# EAGLE design Photon_Micro_OLED_Shield (EAGLE 7.1.0)
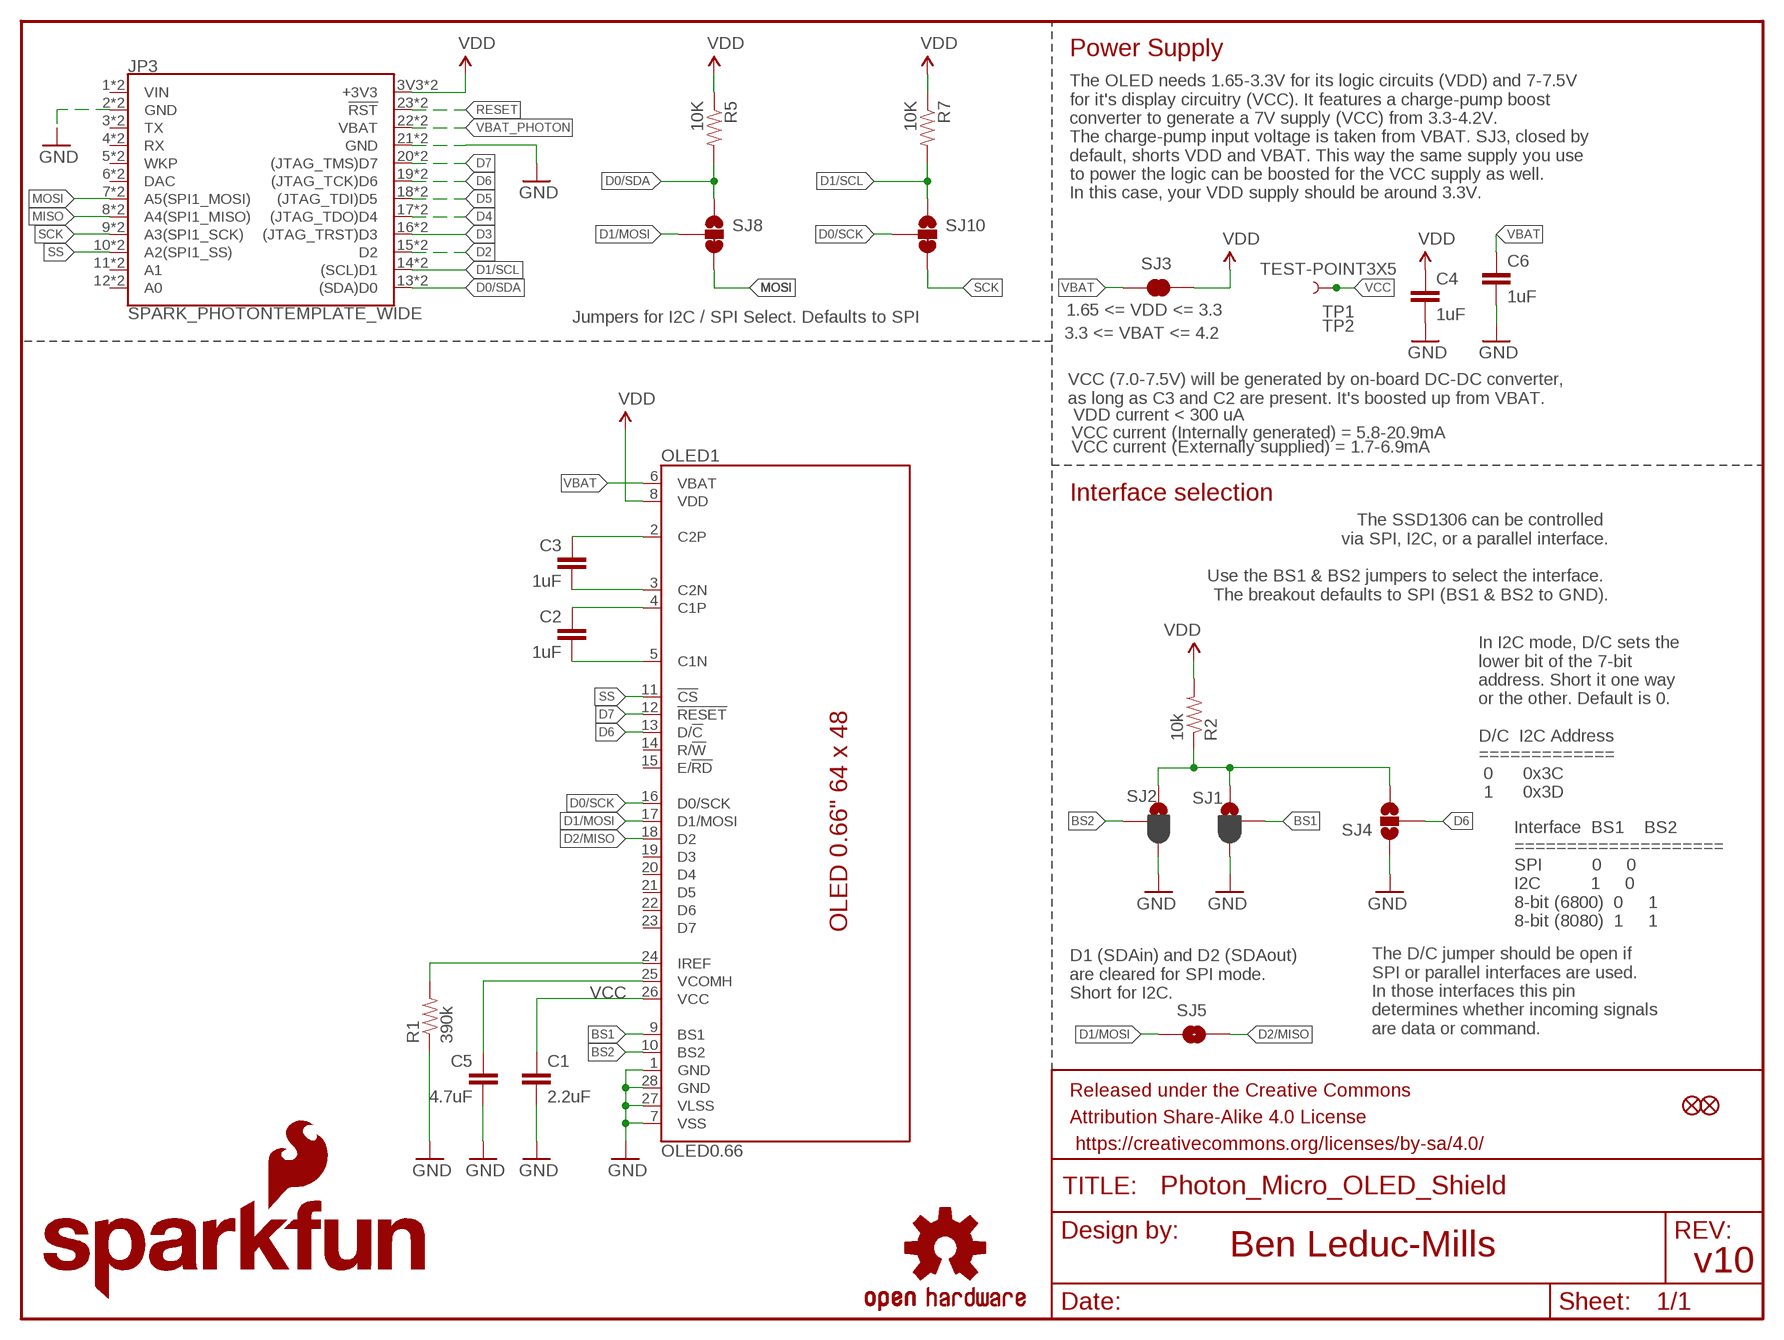
[diagram p0: schematic, sheet 1]

## Parts
C1  2.2uF  2.2UF-25V-+80/-20(0805)  [0805-CAP]
C2  1uF  1UF-25V-10%(0805)"  [0805-CAP]
C3  1uF  1UF-25V-10%(0805)"  [0805-CAP]
C4  1uF  CAP0603-CAP  [0603-CAP]
C5  4.7uF  4.7UF-16V-20%,+80%-(1206)  [1206-CAP]
C6  1uF  CAP0603-CAP  [0603-CAP]
FID1  FIDUCIAL1X2  [FIDUCIAL-1X2]
FID2  FIDUCIAL1X2  [FIDUCIAL-1X2]
FRAME1  FRAME-LETTER  [CREATIVE_COMMONS]
JP3  SPARK_PHOTONTEMPLATE_WIDE  [SPARK_PHOTON_TEMPLATE_WIDE]
LOGO1  SFE_LOGO_NAME_FLAME.1_INCH  [SFE_LOGO_NAME_FLAME_.1]
LOGO2  SFE_LOGO_NAME_FLAME.1_INCH  [SFE_LOGO_NAME_FLAME_.1]
LOGO3  OSHW-LOGOS  [OSHW-LOGO-S]
OLED1  OLED0.66  [OLED-0.66-64X48]
R1  390k  RESISTOR0603-RES  [0603-RES]
R2  10k  RESISTOR0603-RES  [0603-RES]
R5  10K  10KOHM1/10W1%(0603)0603  [0603-RES]
R7  10K  10KOHM1/10W1%(0603)0603  [0603-RES]
SJ1  BS1  JUMPER-PAD-3-2OF3_NC_BY_PASTE  [PAD-JUMPER-3-2OF3_NC_BY_PASTE_YES_SILK_FULL_BOX]
SJ2  BS2  JUMPER-PAD-3-2OF3_NC_BY_PASTE  [PAD-JUMPER-3-2OF3_NC_BY_PASTE_YES_SILK_FULL_BOX]
SJ3  JUMPER-PAD-2-NC_BY_TRACE  [PAD-JUMPER-2-NC_BY_TRACE_YES_SILK]
SJ4  JUMPER-PAD-3-NOYES_SILK  [PAD-JUMPER-3-NO_YES_SILK]
SJ5  JUMPER-PAD-2-NOYES_SILK  [PAD-JUMPER-2-NO_YES_SILK]
SJ8  JUMPER-PAD-3-2OF3_NC_BY_TRACE_SMALL  [PAD-JUMPER-3-2OF3_NC_BY_TRACE_YES_SILK_FULL_BOX]
SJ10  JUMPER-PAD-3-2OF3_NC_BY_TRACE_SMALL  [PAD-JUMPER-3-2OF3_NC_BY_TRACE_YES_SILK_FULL_BOX]
TP1  TEST-POINT3X5  [PAD.03X.05]
TP2  TEST-POINT3X5  [PAD.03X.05]

## Nets
BS1: OLED1.9(BS1) SJ1.2
BS2: OLED1.10(BS2) SJ2.2
C1N: C2.2 OLED1.5(C1N)
C1P: C2.1 OLED1.4(C1P)
C2N: C3.2 OLED1.3(C2N)
C2P: C3.1 OLED1.2(C2P)
D0/SCK: OLED1.16(D0/SCK) SJ10.2
D0/SDA: JP3.13((SDA)D0) JP3.D0((SDA)D0) R5.2 SJ8.1
D1/MOSI: OLED1.17(D1/MOSI) SJ5.1 SJ8.2
D1/SCL: JP3.14((SCL)D1) JP3.D1((SCL)D1) R7.2 SJ10.1
D2: JP3.15(D2) JP3.D2
D2/MISO: OLED1.18(D2) SJ5.2
D3: JP3.16((JTAG_TRST)D3) JP3.D3((JTAG_TRST)D3)
D4: JP3.17((JTAG_TDO)D4) JP3.D4((JTAG_TDO)D4)
D5: JP3.18((JTAG_TDI)D5) JP3.D5((JTAG_TDI)D5)
D6: JP3.19((JTAG_TCK)D6) JP3.D6((JTAG_TCK)D6) OLED1.13(D/!C!) SJ4.2
D7: JP3.20((JTAG_TMS)D7) JP3.D7((JTAG_TMS)D7) OLED1.12(!RESET!)
GND: C1.2 C4.2 C5.2 C6.2 JP3.2(GND) JP3.21(GND) JP3.GND@0(GND) JP3.GND@2(GND) OLED1.1(GND) OLED1.7(VSS) OLED1.27(VLSS) OLED1.28(GND) R1.1 SJ1.3 SJ2.3 SJ4.1
IREF: OLED1.24(IREF) R1.2
MISO: JP3.8(A4(SPI1_MISO)) JP3.A4(A4(SPI1_MISO))
MOSI: JP3.7(A5(SPI1_MOSI)) JP3.A5(A5(SPI1_MOSI)) SJ8.3
RESET: JP3.23(!RST!) JP3.RST(!RST!)
SCK: JP3.9(A3(SPI1_SCK)) JP3.A3(A3(SPI1_SCK)) SJ10.3
SS: JP3.10(A2(SPI1_SS)) JP3.A2(A2(SPI1_SS)) OLED1.11(!CS!)
VBAT: C6.1 OLED1.6(VBAT) SJ3.1
VBAT_PHOTON: JP3.22(VBAT) JP3.VBAT
VCC: C1.1 OLED1.26(VCC) TP1.P$1 TP2.P$1
VCOMH: C5.1 OLED1.25(VCOMH)
VDD: C4.1 JP3.3V3(+3V3) JP3.24(+3V3) OLED1.8(VDD) R2.2 R5.1 R7.1 SJ3.2
VDD_PU: R2.1 SJ1.1 SJ2.1 SJ4.3
Unconnected: JP3.1(VIN) JP3.3(TX) JP3.4(RX) JP3.5(WKP) JP3.6(DAC) JP3.11(A1) JP3.12(A0) JP3.A0 JP3.A1 JP3.DAC JP3.RX JP3.TX JP3.VIN JP3.WKP OLED1.14(R/!W!) OLED1.15(E/!RD!) OLED1.19(D3) OLED1.20(D4) OLED1.21(D5) OLED1.22(D6) OLED1.23(D7)

## Notes on the sheet
- Power Supply
- The OLED needs 1.65-3.3V for its logic circuits (VDD) and 7-7.5V
  for it's display circuitry (VCC). It features a charge-pump boost 
  converter to generate a 7V supply (VCC) from 3.3-4.2V. 
  The charge-pump input voltage is taken from VBAT. SJ3, closed by 
  default, shorts VDD and VBAT. This way the same supply you use 
  to power the logic can be boosted for the VCC supply as well. 
  In this case, your VDD supply should be around 3.3V.
- 1.65 <= VDD <= 3.3
- Jumpers for I2C / SPI Select. Defaults to SPI
- 3.3 <= VBAT <= 4.2
- VCC (7.0-7.5V) will be generated by on-board DC-DC converter, 
  as long as C3 and C2 are present. It's boosted up from VBAT.
- VDD current < 300 uA
- VCC current (Internally generated) = 5.8-20.9mA
- VCC current (Externally supplied) = 1.7-6.9mA
- Interface selection
- The SSD1306 can be controlled 
  via SPI, I2C, or a parallel interface.
  
  Use the BS1 & BS2 jumpers to select the interface. 
  The breakout defaults to SPI (BS1 & BS2 to GND).
- In I2C mode, D/C sets the 
  lower bit of the 7-bit 
  address. Short it one way
  or the other. Default is 0. 
  
  D/C  I2C Address
  =============
   0      0x3C
   1      0x3D
- Interface  BS1    BS2
  ====================
  SPI          0     0
  I2C          1     0
  8-bit (6800)  0     1
  8-bit (8080)  1     1
- D1 (SDAin) and D2 (SDAout)
  are cleared for SPI mode. 
  Short for I2C.
- The D/C jumper should be open if
  SPI or parallel interfaces are used.
  In those interfaces this pin 
  determines whether incoming signals 
  are data or command.
- Ben Leduc-Mills
- v10

## Library data of the parts
C1 = SparkFun-Capacitors:2.2UF-25V-+80/-20(0805): CAP-11624; PROD_ID: CAP-11624
C2 C3 = SparkFun-Capacitors:1UF-25V-10%(0805): CAP-08064
C4 C6 = SparkFun-Passives:CAP: Capacitor Standard 0603 ceramic capacitor, and 0.1" leaded capacitor.; PROD_ID: CAP-00868
C5 = SparkFun-Capacitors:4.7UF-16V-20%,+80%-(1206): CAP-10300; PROD_ID: CAP-10300
FID1 FID2 = SparkFun-Aesthetics:FIDUCIAL: Fiducial Alignment Points Various fiducial points for machine vision alignment.
FRAME1 = SparkFun-Aesthetics:FRAME-LETTER: Schematic Frame Standard 8.5x11 US Letter frame; DESIGNER: NAME; VERSION: v01
JP3 = template_temp:SPARK_PHOTON
LOGO1 LOGO2 = SparkFun-Aesthetics:SFE_LOGO_NAME_FLAME: SFE Logo, name and flame This is the SparkFun full logo. The logo on the schematic will always be the same size; the package variant is the height of the flame part of the logo. Default layer for the logo on the board is tSilk.
LOGO3 = SparkFun-Aesthetics:OSHW-LOGO: Open Source Hardware Logo This logo indicates the piece of hardware it is found on incorporates a OSHW license and/or adheres to the definition of open source hardware found here: http://freedomdefined.org/OSHW
OLED1 = microView-temp:OLED0.66; PROD_ID: LCD-12019
R1 = SparkFun-Passives:RESISTOR: Resistor Basic schematic elements and footprints for 0603, 1206, and PTH resistors.; PROD_ID: RES-12024
R2 = SparkFun-Passives:RESISTOR: Resistor Basic schematic elements and footprints for 0603, 1206, and PTH resistors.; PROD_ID: RES-00824
R5 R7 = SparkFun-Resistors:10KOHM1/10W1%(0603): RES-00824; PROD_ID: RES-00824
SJ1 SJ2 = SparkFun-Passives:JUMPER-PAD-3-2OF3_NC_BY_PASTE
SJ3 = SparkFun-Passives:JUMPER-PAD-2-NC_BY_TRACE
SJ4 = SparkFun-Passives:JUMPER-PAD-3-NO
SJ5 = SparkFun-Passives:JUMPER-PAD-2-NO
SJ8 SJ10 = SparkFun-Passives:JUMPER-PAD-3-2OF3_NC_BY_TRACE
TP1 TP2 = SparkFun-Passives:TEST-POINT: Bare copper test points for troubleshooting or ICT

## Board
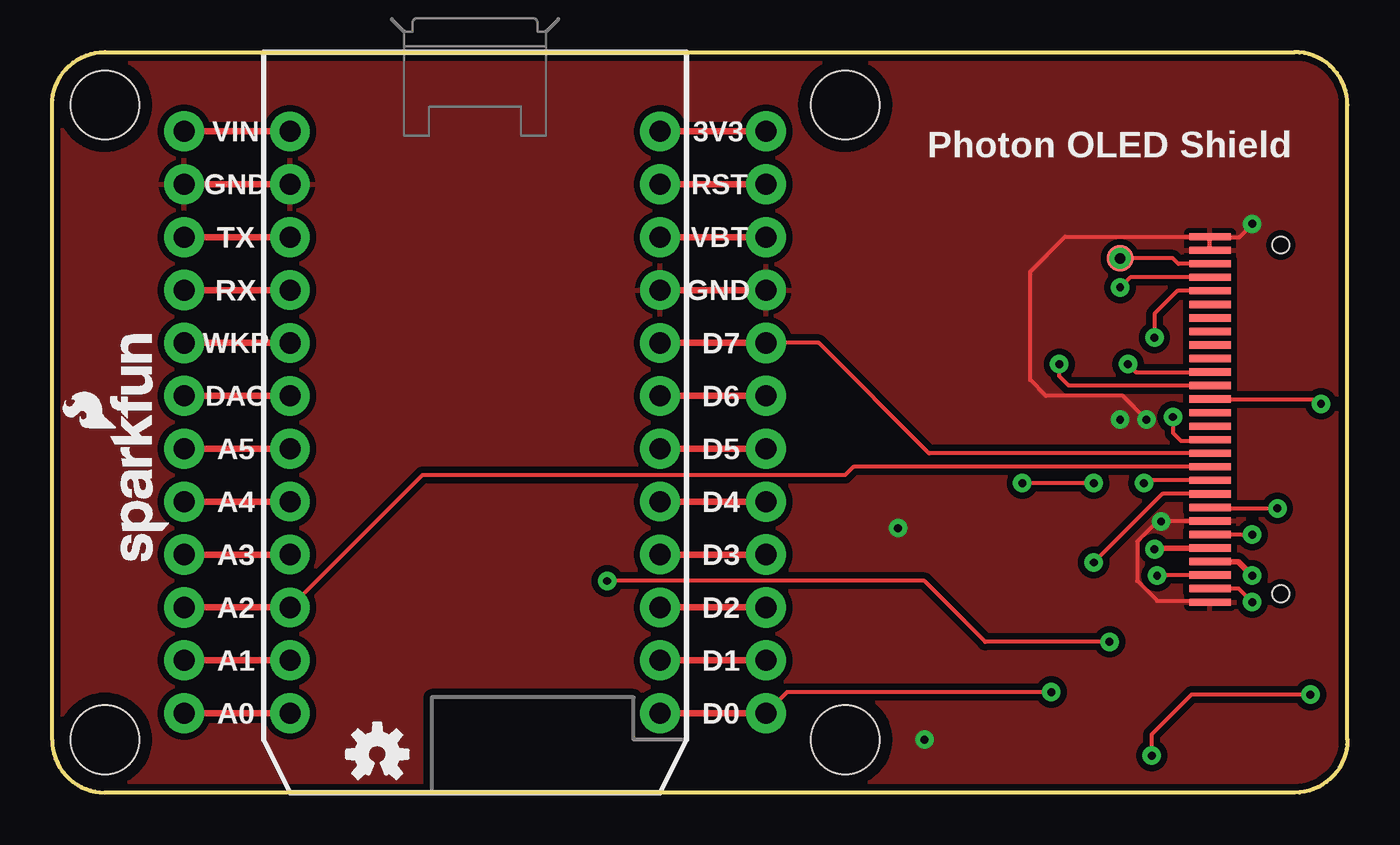
[diagram p1: board, top side]
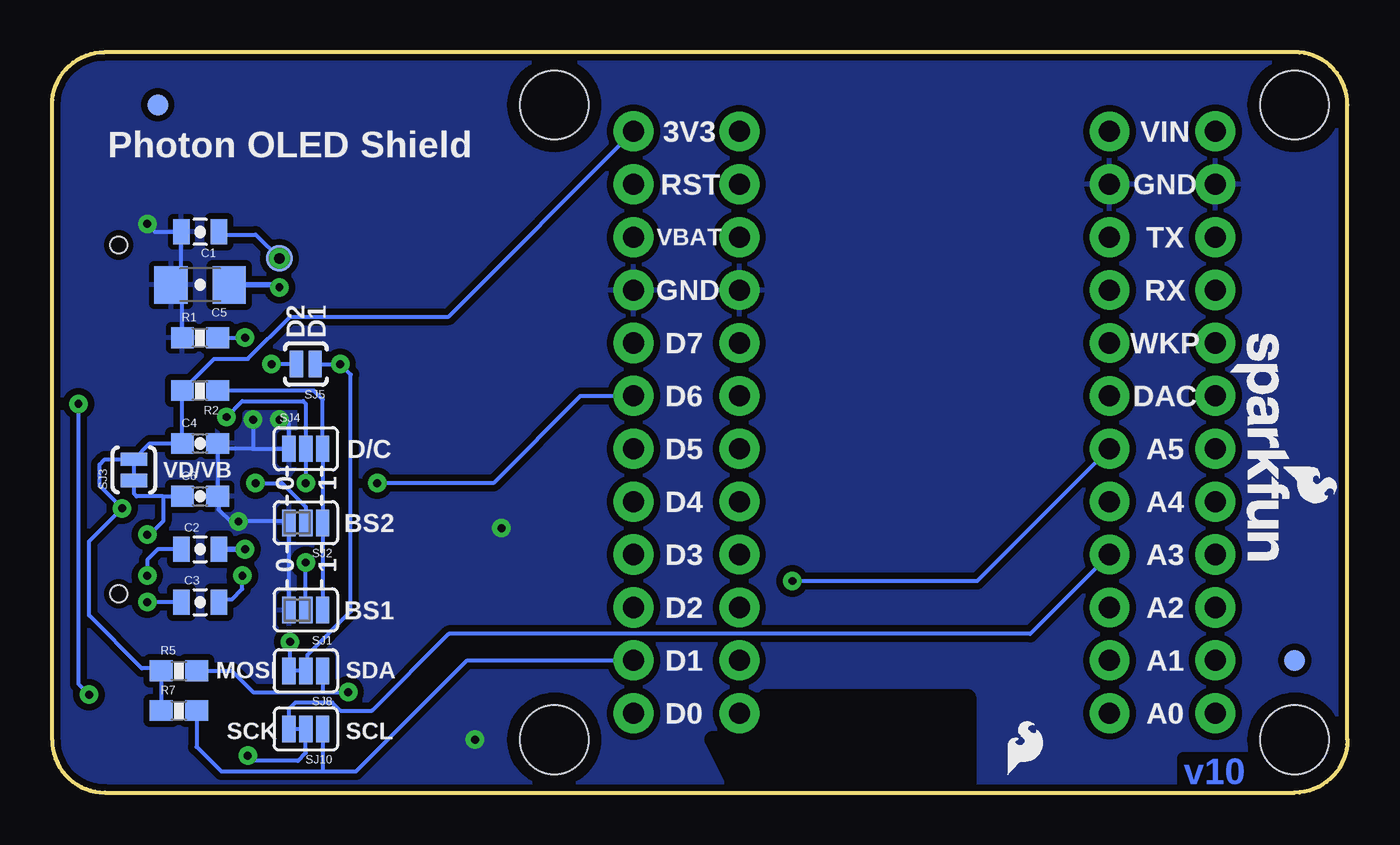
[diagram p2: board, bottom side, seen from below]

Size 62.23 x 35.56 mm. Coordinates in mm from the lower left corner, seen from the top.
Outline: 2.54,35.56 59.69,35.56 arc-90 62.23,33.02 62.23,2.54 arc-90 59.69,0 2.54,0 arc-90 0,2.54 0,33.02 arc-90 2.54,35.56
Copper layers (1*16): Top 0.035mm / dielectric 1.5mm / Bottom 0.035mm
Design rules "SparkFun-2-layer": minimum track width 7mil, minimum drill 15mil, track to track 8mil, track to pad 8mil, pad to pad 8mil, via to via 8mil, smd to smd 8mil, copper to edge 8mil, drill to drill 8mil, minimum pad ring 12mil, minimum via ring 10mil, stop-mask expansion 4mil, vias tented up to drill 20mil, thermal gap 10mil

### Footprints (pad centres in the part's own frame; a part is rotated, then mirrored left to right if it is on the bottom)
0805-CAP = smd 0.8 x 1.2: 1 -0.9,0; 2 0.9,0
0603-CAP = smd 1.1 x 1: 1 -0.85,0; 2 0.85,0
1206-CAP = smd 1.6 x 1.8: 1 -1.4,0; 2 1.4,0
FIDUCIAL-1X2 = smd 1 x 1: 1 0,0
SPARK_PHOTON_TEMPLATE_WIDE = drill 1.016 pad 1.905: 1 1.27,31.75; 2 1.27,29.21; 3 1.27,26.67; 4 1.27,24.13; 5 1.27,21.59; 6 1.27,19.05; 7 1.27,16.51; 8 1.27,13.97; 9 1.27,11.43; 10 1.27,8.89; 11 1.27,6.35; 12 1.27,3.81; 13 19.05,3.81; 14 19.05,6.35; 15 19.05,8.89; 16 19.05,11.43; 17 19.05,13.97; 18 19.05,16.51; 19 19.05,19.05; 20 19.05,21.59; 21 19.05,24.13; 22 19.05,26.67; 23 19.05,29.21; 24 19.05,31.75 | drill 1.016 pad 1.93: 3V3 24.13,31.75; A0 -3.81,3.81; A1 -3.81,6.35; A2 -3.81,8.89; A3 -3.81,11.43; A4 -3.81,13.97; A5 -3.81,16.51; D0 24.13,3.81; D1 24.13,6.35; D2 24.13,8.89; D3 24.13,11.43; D4 24.13,13.97; D5 24.13,16.51; D6 24.13,19.05; D7 24.13,21.59; DAC -3.81,19.05; GND@0 -3.81,29.21; GND@2 24.13,24.13; RST 24.13,29.21; RX -3.81,24.13; TX -3.81,26.67; VBAT 24.13,26.67; VIN -3.81,31.75; WKP -3.81,21.59 | hole 3.302: -7.62,33.02; 27.94,33.02; -7.62,2.54; 27.94,2.54
OLED-0.66-64X48 = smd 0.35 x 2: 1 0,0; 2 0.65,0; 3 1.3,0; 4 1.95,0; 5 2.6,0; 6 3.25,0; 7 3.9,0; 8 4.55,0; 9 5.2,0; 10 5.85,0; 11 6.5,0; 12 7.15,0; 13 7.8,0; 14 8.45,0; 15 9.1,0; 16 9.75,0; 17 10.4,0; 18 11.05,0; 19 11.7,0; 20 12.35,0; 21 13,0; 22 13.65,0; 23 14.3,0; 24 14.95,0; 25 15.6,0; 26 16.25,0; 27 16.9,0; 28 17.55,0 | hole 0.8: 17.15,-3.4; 0.4,-3.4
0603-RES = smd 1.1 x 1: 1 -0.85,0; 2 0.85,0
PAD-JUMPER-3-2OF3_NC_BY_PASTE_YES_SILK_FULL_BOX = smd 0.635 x 1.27: 1 -0.813,0; 2 0,0; 3 0.813,0
PAD-JUMPER-2-NC_BY_TRACE_YES_SILK = smd 0.635 x 1.27: 1 -0.508,0; 2 0.508,0
PAD-JUMPER-3-NO_YES_SILK = smd 0.635 x 1.27: 1 -0.813,0; 2 0,0; 3 0.813,0
PAD-JUMPER-2-NO_YES_SILK = smd 0.635 x 1.27: 1 -0.45,0; 2 0.45,0
PAD-JUMPER-3-2OF3_NC_BY_TRACE_YES_SILK_FULL_BOX = smd 0.635 x 1.27: 1 -0.813,0; 2 0,0; 3 0.813,0
PAD.03X.05 = smd 1.27 x 1.27: P$1 0,0

### Placement (x,y rotation side)
C1  55.12,26.92 180 bottom
C2  55.12,11.68 0 bottom
C3  55.12,9.14 0 bottom
C4  55.12,16.76 0 bottom
C5  55.12,24.38 180 bottom
C6  55.12,14.22 0 bottom
FID1  2.54,6.35 270 bottom
FID2  57.15,33.02 270 bottom
FRAME1  -1.27,-15.24 0 top  (outside the outline)
JP3  10.16,0 0 top
LOGO1  5.71,10.67 90 top
LOGO2  5.71,22.48 270 bottom
LOGO3  15.62,1.84 0 top
OLED1  55.63,9.14 90 top
R1  55.12,21.84 0 bottom
R2  55.12,19.3 180 bottom
R5  56.13,5.84 0 bottom
R7  56.13,3.94 0 bottom
SJ1  50.04,8.76 180 bottom
SJ2  50.04,12.95 180 bottom
SJ3  58.29,15.49 90 bottom
SJ4  50.04,16.51 0 bottom
SJ5  50.04,20.57 180 bottom
SJ8  50.04,5.84 180 bottom
SJ10  50.04,3.05 180 bottom
TP1  51.31,25.65 270 bottom
TP2  51.31,25.65 90 top
U$1  [SFE_LOGO_FLAME_.1]  16.64,0.51 0 bottom

### Tracks (layer width: path | path; a pad name or v marks a point on that pad's centre or on a via)
BS1  (via drill 0.38)
  Top 0.203: OLED1.9 53.33,14.34 v50.04,11.05
  Bottom 0.203: SJ1.2 v50.04,11.05
BS2  (via drill 0.38)
  Top 0.203: OLED1.10 55.62,14.99 52.58,14.99 v52.45,14.86
  Bottom 0.203: v52.45,14.86 51.18,14.86 50.04,13.72 SJ2.2
C1N  (via drill 0.38)
  Top 0.178: v52.96,11.68 53.09,11.68 53.09,11.74
  Top 0.254: OLED1.5 53.09,11.74 53.02,11.74
  Bottom 0.254: C2.2 v52.96,11.68
C1P  (via drill 0.38)
  Top 0.254: OLED1.4 56.98,11.09 v57.66,10.41
  Bottom 0.203: C2.1 57.15,11.68 57.66,11.18 v57.66,10.41
C2N  (via drill 0.38)
  Top 0.203: OLED1.3 53.12,10.44
  Top 0.254: 53.12,10.44 v53.09,10.41
  Bottom 0.203: 54.22,9.28 53.58,9.28 53.09,9.78 v53.09,10.41
  Bottom 0.254: C3.2 54.22,9.28
C2P  (via drill 0.38)
  Top 0.203: v57.66,9.14 57.01,9.79 OLED1.2
  Bottom 0.203: C3.1 v57.66,9.14
D0/SCK  (via drill 0.38)
  Top 0.203: OLED1.16 60.73,18.89 v60.96,18.67 | v60.45,4.7 54.74,4.7 52.83,2.79 v52.83,1.78
  Bottom 0.203: SJ10.2 50.04,1.91 50.42,1.52 52.58,1.52 v52.83,1.78 | v60.96,18.67 60.96,5.21 v60.45,4.7
D0/SDA  (via drill 0.38)
  Top 0.203: v48.01,4.83 35.31,4.83 JP3.D0
  Bottom 0.203: R5.2 53.59,5.84 52.58,4.83 49.23,4.83 | 49.23,4.83 v48.01,4.83 | SJ8.1 49.23,4.83
D1/MOSI  (via drill 0.38)
  Top 0.203: OLED1.17 48.85,19.54 48.39,20 v48.39,20.57
  Bottom 0.178: 49.97,5.84 SJ8.2
  Bottom 0.203: 49.97,5.84 49.97,6.6 47.88,8.7 47.88,20.07 v48.39,20.57 SJ5.1
D1/SCL
  Top 0.178: 29.21,6.41 JP3.14
  Bottom 0.203: R7.2 55.28,2.2 54.1,1.02 49.23,1.02 | 49.23,1.02 47.62,1.02 42.29,6.35 JP3.D1 | 49.23,2.92 SJ10.1 49.23,1.02
D2/MISO  (via drill 0.38)
  Top 0.203: v51.69,20.57 52.07,20.19 54.74,20.19 OLED1.18
  Bottom 0.203: SJ5.2 v51.69,20.57
D6  (via drill 0.38)
  Top 0.203: v53.85,18.03 53.85,17.27 54.23,16.89 55.57,16.89 OLED1.13 | v50.04,14.86 v46.61,14.86
  Bottom 0.203: v53.85,18.03 53.09,18.8 50.16,18.8 50.04,18.67 SJ4.2 v50.04,14.86 | JP3.D6 36.83,19.05 41.02,14.86 v46.61,14.86
D7
  Top 0.203: OLED1.12 42.13,16.29 36.83,21.59 JP3.D7
GND  (via drill 0.38)
  Top 0.178: 55.56,9.21 OLED1.1
  Top 0.203: OLED1.27 OLED1.28 | 55.56,9.21 53.09,9.21 52.13,10.16 52.13,12.06 53.09,13.02 v53.28,13.02 55.6,13.02 OLED1.7 | OLED1.28 55.65,26.67 57.02,26.67 v57.66,27.3 | v52.58,17.91 51.44,19.05 47.75,19.05 46.99,19.81 46.99,25.02 48.66,26.69 OLED1.28
  Bottom 0.203: R1.1 55.97,23.83 C5.2 | SJ1.3 SJ2.3 50.91,13.02 v53.28,13.02 53.66,13.02 54.23,13.59 54.23,14.19 C6.2 C4.2 54.01,16.51 52.58,16.51 | C5.2 56.02,24.88 C1.2 57.28,26.92 v57.66,27.3 | 57.15,25.02 C5.2 | v51.31,17.91 51.05,17.91 50.85,17.7 SJ4.1 52.58,16.51 | 52.58,17.95 v52.58,17.91 52.58,16.51
  other vias: 40.64,12.7 41.91,2.54
  pour Bottom (isolate 0.305): 0,35.56 0,0 62.23,0 62.23,35.56
  pour Top (isolate 0.305): 0,35.56 0,0 62.23,0 62.23,35.56
IREF  (via drill 0.38)
  Top 0.203: OLED1.24 54.07,24.09 52.96,22.99 v52.96,21.84
  Bottom 0.203: R1.2 v52.96,21.84
MOSI  (via drill 0.38)
  Top 0.203: v50.8,7.24 44.83,7.24 41.91,10.16 v26.67,10.16
  Bottom 0.203: 50.98,5.97 SJ8.3 50.85,6.3 50.8,6.35 v50.8,7.24 | v26.67,10.16 17.78,10.16 JP3.7
SCK
  Bottom 0.203: JP3.9 15.24,7.62 43.18,7.62 46.86,3.94 48.39,3.94 48.77,4.32 50.55,4.32 50.85,4.01 SJ10.3
SS
  Top 0.203: OLED1.11 38.5,15.64 38.1,15.24 17.78,15.24 JP3.10
VBAT  (via drill 0.38)
  Top 0.203: OLED1.6 57.14,12.39 57.15,12.38 v57.66,12.38
  Bottom 0.178: 55.88,14.22 C6.1
  Bottom 0.203: 56.9,14.22 C6.1 | 56.9,14.22 56.9,13.02 57.53,12.38 v57.66,12.38 | 56.9,14.22 58.17,14.22 58.29,14.35 SJ3.1
VCC  (via drill 0.51)
  Top 0.203: OLED1.26 54.11,25.39 53.85,25.65 TP2.P$1
  Bottom 0.203: C1.1 54.09,26.8 52.45,26.8 TP2.P$1
  other vias: 51.31,25.65
VCOMH  (via drill 0.38)
  Top 0.203: OLED1.25 51.8,24.74 v51.31,24.26
  Bottom 0.254: C5.1 51.44,24.38 v51.31,24.26
VDD  (via drill 0.38)
  Top 0.203: OLED1.8 55.67,13.65 v58.86,13.65
  Bottom 0.203: R7.1 R5.1 57.11,5.97 57.91,5.97 60.45,8.51 60.45,12.06 v58.86,13.65 59.94,14.73 59.94,15.75 59.69,16 SJ3.2 57.53,16.76 C4.1 R2.2 54.44,20.83 52.83,20.83 50.8,22.86 43.18,22.86 JP3.3V3
VDD_PU
  Bottom 0.203: R2.1 49.66,19.3 49.23,18.87 SJ4.3 SJ2.1 SJ1.1

### Text on the board
Bottom: v10
tPlace: Photon OLED Shield
bPlace: Photon OLED Shield | D1 | D2 | D/C | 1 | 0 | VD/VB | BS2 | 1 | 0 | BS1 | SDA | MOSI | SCL | SCK
Measures: Units in Inches
tDocu: Ben Leduc-Mills